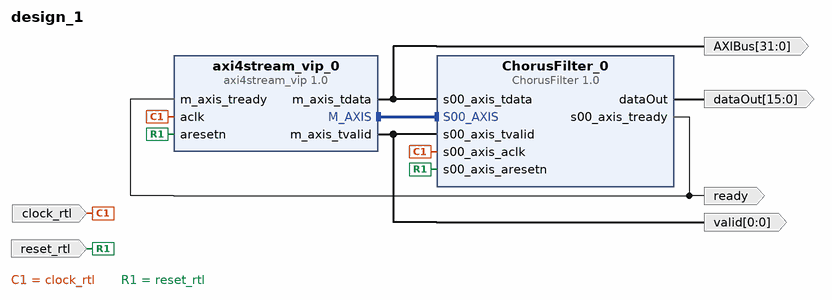
[diagram p0: block diagram of the top level]
# Vivado block design design_1, xc7a100tcsg324-1, Vivado 2017.2
create_bd_design design_1

create_bd_port -dir I -type rst reset_rtl
set_property -dict {CONFIG.POLARITY ACTIVE_LOW} [get_bd_ports reset_rtl]
create_bd_port -dir I -type clk clock_rtl
set_property -dict {CONFIG.FREQ_HZ 100000000 CONFIG.PHASE 0.000} [get_bd_ports clock_rtl]
create_bd_port -dir O -from 31 -to 0 -type data AXIBus
create_bd_port -dir O -from 0 -to 0 valid
create_bd_port -dir O ready
create_bd_port -dir O -from 15 -to 0 dataOut

create_bd_cell -type ip -vlnv xilinx.com:ip:axi4stream_vip:1.0 axi4stream_vip_0
set_property -dict {CONFIG.INTERFACE_MODE MASTER CONFIG.TDATA_NUM_BYTES 4} [get_bd_cells axi4stream_vip_0]
create_bd_cell -type ip -vlnv user.org:user:ChorusFilter:1.0 ChorusFilter_0

# ---- connections ----

connect_bd_intf_net [get_bd_intf_pins axi4stream_vip_0/M_AXIS] [get_bd_intf_pins ChorusFilter_0/S00_AXIS]
connect_bd_net -net clk_wiz_clk_out1 [get_bd_ports clock_rtl] [get_bd_pins axi4stream_vip_0/aclk] [get_bd_pins ChorusFilter_0/s00_axis_aclk]
connect_bd_net [get_bd_pins axi4stream_vip_0/m_axis_tdata] [get_bd_ports AXIBus] [get_bd_pins ChorusFilter_0/s00_axis_tdata]
connect_bd_net [get_bd_pins axi4stream_vip_0/m_axis_tvalid] [get_bd_ports valid] [get_bd_pins ChorusFilter_0/s00_axis_tvalid]
connect_bd_net [get_bd_pins ChorusFilter_0/s00_axis_tready] [get_bd_ports ready] [get_bd_pins axi4stream_vip_0/m_axis_tready]
connect_bd_net [get_bd_ports reset_rtl] [get_bd_pins axi4stream_vip_0/aresetn] [get_bd_pins ChorusFilter_0/s00_axis_aresetn]
connect_bd_net [get_bd_pins ChorusFilter_0/dataOut] [get_bd_ports dataOut]

validate_bd_design
save_bd_design
